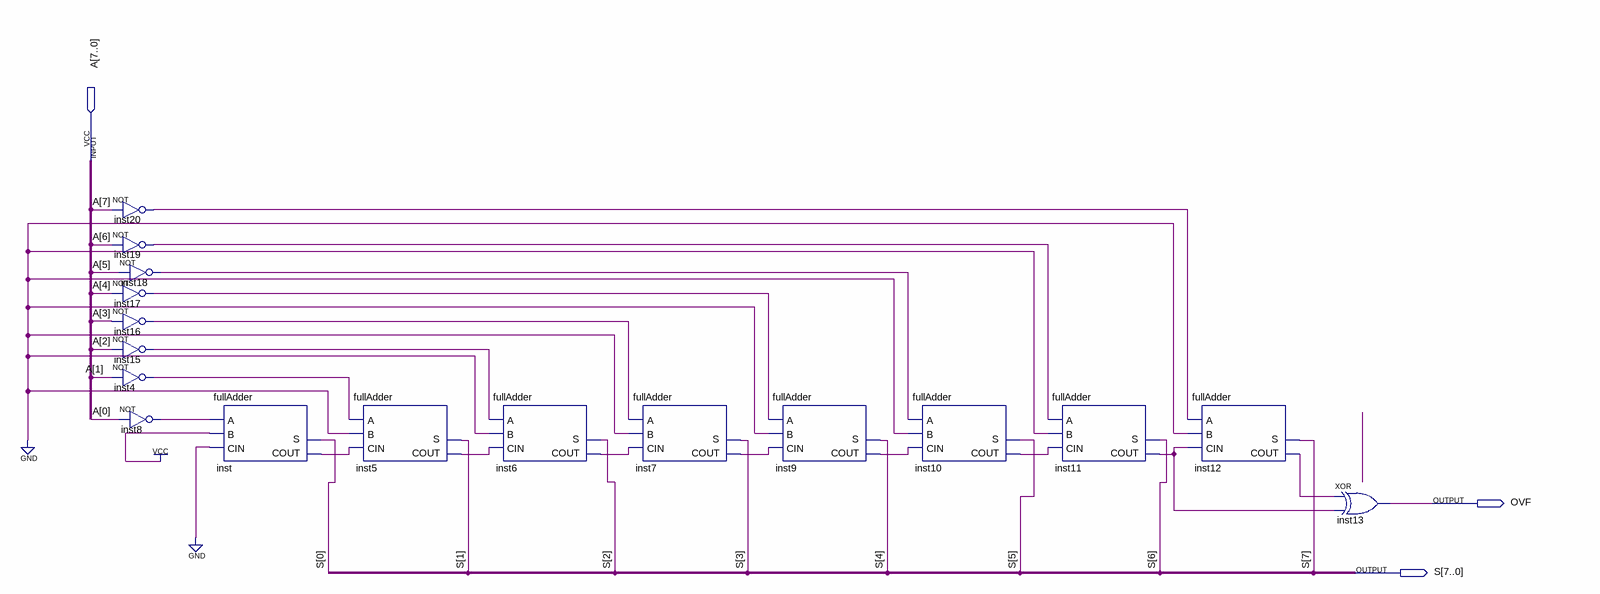
[diagram p0: schematic sheet]
// Quartus schematic complement2.bdf as structural Verilog: 17 symbols, 3 pins
module complement2 (
  input  [7:0] A,
  output OVF,
  output [7:0] S
);

  wire inst4_out, inst5_cout, inst6_cout, inst7_cout, inst8_out, inst9_cout, inst10_cout, inst11_cout,
       inst12_cout, inst15_out, inst16_out, inst17_out, inst18_out, inst19_out, inst20_out, inst_cout;

  not inst20 (inst20_out, A[7]);
  not inst19 (inst19_out, A[6]);
  not inst18 (inst18_out, A[5]);
  not inst17 (inst17_out, A[4]);
  not inst16 (inst16_out, A[3]);
  not inst15 (inst15_out, A[2]);
  not inst4 (inst4_out, A[1]);
  not inst8 (inst8_out, A[0]);
  fullAdder inst (.A(inst8_out), .B(1'b1), .CIN(1'b0), .S(S[0]), .COUT(inst_cout));
  fullAdder inst5 (.A(inst4_out), .B(1'b0), .CIN(inst_cout), .S(S[1]), .COUT(inst5_cout));
  fullAdder inst6 (.A(inst15_out), .B(1'b0), .CIN(inst5_cout), .S(S[2]), .COUT(inst6_cout));
  fullAdder inst7 (.A(inst16_out), .B(1'b0), .CIN(inst6_cout), .S(S[3]), .COUT(inst7_cout));
  fullAdder inst9 (.A(inst17_out), .B(1'b0), .CIN(inst7_cout), .S(S[4]), .COUT(inst9_cout));
  fullAdder inst10 (.A(inst18_out), .B(1'b0), .CIN(inst9_cout), .S(S[5]), .COUT(inst10_cout));
  fullAdder inst11 (.A(inst19_out), .B(1'b0), .CIN(inst10_cout), .S(S[6]), .COUT(inst11_cout));
  fullAdder inst12 (.A(inst20_out), .B(1'b0), .CIN(inst11_cout), .S(S[7]), .COUT(inst12_cout));
  xor inst13 (OVF, inst12_cout, inst11_cout);
endmodule
